# Altium schematic sheet DiPho_devboard.SchDoc
size A4; SheetNumber: 1; SheetTotal: 1
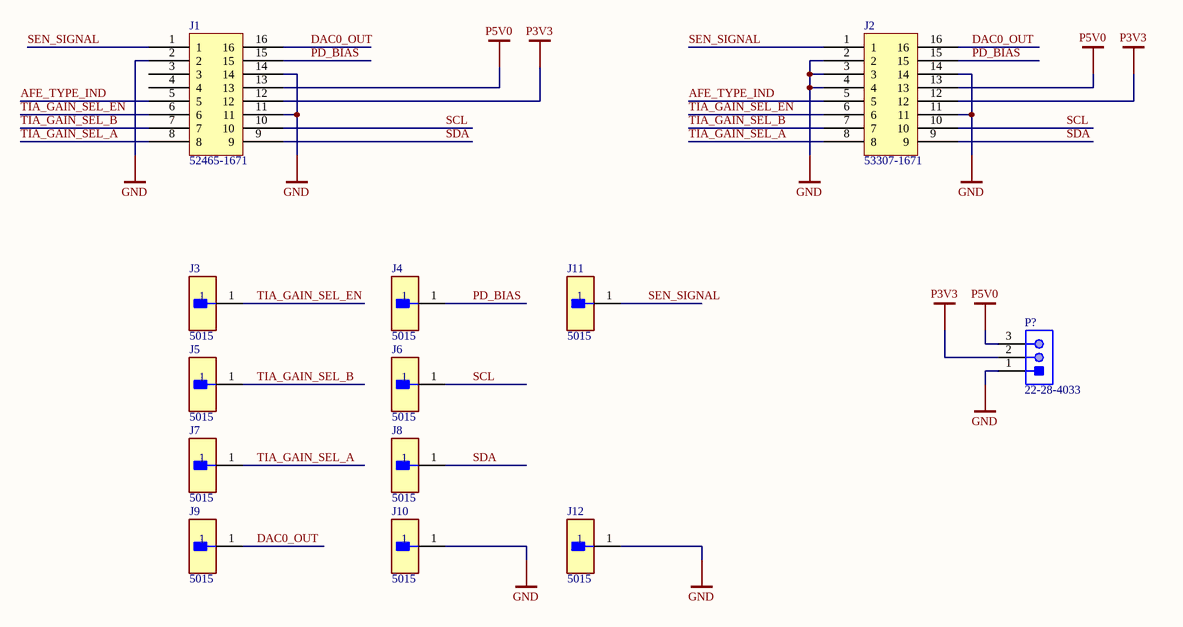
[diagram p0: DiPho_devboard.SchDoc]

## Parts
J1  52465-1671  [524651671]
J2  53307-1671  [533071671]
J3  5015  [FP-5015-MFG]
J4  5015  [FP-5015-MFG]
J5  5015  [FP-5015-MFG]
J6  5015  [FP-5015-MFG]
J7  5015  [FP-5015-MFG]
J8  5015  [FP-5015-MFG]
J9  5015  [FP-5015-MFG]
J10  5015  [FP-5015-MFG]
J11  5015  [FP-5015-MFG]
J12  5015  [FP-5015-MFG]
P?  22-28-4033  [MOLX-22-28-4033_V]

## Nets
GND: J1.2 J1.11 J1.14 J2.2 J2.3 J2.4 J2.11 J2.14 J10.1 J12.1 P?.1
P3V3: J1.12 J2.12 P?.2
P5V0: J1.13 J2.13 P?.3
AFE_TYPE_IND: J1.5 J2.5
DAC0_OUT: J1.16 J2.16 J9.1
PD_BIAS: J1.15 J2.15 J4.1
SCL: J1.10 J2.10 J6.1
SDA: J1.9 J2.9 J8.1
SEN_SIGNAL: J1.1 J2.1 J11.1
TIA_GAIN_SEL_A: J1.8 J2.8 J7.1
TIA_GAIN_SEL_B: J1.7 J2.7 J5.1
TIA_GAIN_SEL_EN: J1.6 J2.6 J3.1

Not connected (* = marked no-connect by the designer): J1 3 4

## Library data of the parts
J1 = 52465-1671: A Connector for Board - Board Connections with A 0.80 mm Pitch. (Molex); Supplier 1: Farnell; Manufacturer: Molex; Manufacturer Part Number: 52465-1671; RoHS: Yes; Category: Headers and Wire Housings; Stock 1: 1320; ComponentLink1URL: https://datasheet.ciiva.com/5130/0524651671-pcb-receptacles-170554-5130522.pdf?src-supplier=Mouser; ComponentLink1Description: https://datasheet.ciiva.com/5130/0524651671-pcb-receptacles-170554-5130522.pdf?src-supplier=Mouser; ComponentLink2URL: https://datasheet.ciiva.com/10078/0524651671-pcb-receptacles-10078959.pdf?src-supplier=Avnet; ComponentLink2Description: https://datasheet.ciiva.com/10078/0524651671-pcb-receptacles-10078959.pdf?src-supplier=Avnet; Supplier Part Number 1: 3500606
J2 = 53307-1671: 0.80mm Pitch Header Surface Mount Dual Row Vertical Stacking 4.50 and 5.50mm Stacking Heights 16 Circuits; Manufacturer: Molex; Supplier 1: Farnell; Manufacturer Part Number: 53307-1671; RoHS: Yes; Category: Headers and Wire Housings; Stock 1: 7000; ComponentLink1URL: https://datasheet.ciiva.com/5130/0533071671-pcb-headers-170920-5130475.pdf?src-supplier=Mouser; ComponentLink1Description: https://datasheet.ciiva.com/5130/0533071671-pcb-headers-170920-5130475.pdf?src-supplier=Mouser; ComponentLink2URL: https://datasheet.ciiva.com/1440/1875052-1440388.pdf?src-supplier=Element14; ComponentLink2Description: https://datasheet.ciiva.com/1440/1875052-1440388.pdf?src-supplier=Element14; ComponentLink3URL: https://datasheet.ciiva.com/10079/0533071671-pcb-headers-10079144.pdf?src-supplier=Avnet; ComponentLink3Description: https://datasheet.ciiva.com/10079/0533071671-pcb-headers-10079144.pdf?src-supplier=Avnet; Supplier Part Number 1: 3499278
J3-J12 = CMP-2000-05183-2: PC TEST POINT MINIATURE; Manufacturer: keystone; Number Of Contacts: 1; Conn Orientation: Straight; Category: Conn; Manufacturer Part Number: 5015; Digikey Description: PC TEST POINT MINIATURE; Automotive: No; Lead Free: Yes; Octopart: https://octopart.com/5015-keystone-3822; ComponentLink2URL: http://www.keyelco.com/product-pdf.cfm?p=1353; Package: 5015; RoHS: TRUE; Device Class L3: unset; Device Class L2: unset; Contact Material: Silver; Device Class L1: Connectors; Height: 1.65mm; ComponentLink2Description: Datasheet
P? = CMP-1676-00001-5: Male Header, Pitch 2.54 mm, 1 x 3 Position, Height 8.38 mm, Tail Length 3.18 mm, RoHS, Bulk; Manufacturer: Molex; Rows: 1; Voltage Rating: 250 V; Current Rating: 4 A; Min Operating Temperature: 0 degC; Lead Pitch: 0.1 inch; Packaging: Bulk; Contact Finish: Gold; RoHSCompliant: true; Contact Material: Brass; PackageReference: 22-28-4033; REACH SVHC: Unknown; PackageDescription: Male Header, Pitch 2.54 mm, 1 x 3 Position, Height 8.38 mm, Tail Length 3.18 mm; ComponentLink2URL: http://www.molex.com/pdm_docs/sd/022284033_sd.pdf; Height: 8.38 mm; Mounting Technology: Through Hole; ComponentLink1Description: Manufacturer URL; Length: 7.62 mm; Mount: Through Hole; DatasheetVersion: Rev. G, 01/2012; Max Operating Temperature: 75 degC; ComponentLink2Description: Datasheet; Colour: Black; Pins: 3; Contact Plating: Gold; Package Quantity: 1; ComponentLink1URL: http://www.molex.com/